# EAGLE design LowPass (EAGLE 9.3.0)
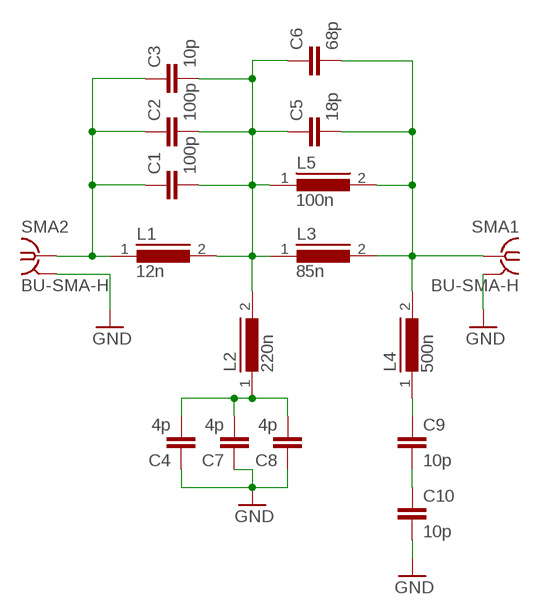
[diagram p0: schematic, sheet 1]

## Parts
C1  100p  C-EUC0805  [C0805]
C2  100p  C-EUC0805  [C0805]
C3  10p  C-EUC0805  [C0805]
C4  4p  C-EUC1206  [C1206]
C5  18p  C-EUC0805  [C0805]
C6  68p  C-EUC0402  [C0402]
C7  4p  C-EUC1206  [C1206]
C8  4p  C-EUC1206  [C1206]
C9  10p  C-EUC0805  [C0805]
C10  10p  C-EUC0805  [C0805]
L1  12n  MICC10  [MICC10]
L2  220n  MICC10  [MICC10]
L3  85n  MICC10  [MICC10]
L4  500n  MICC10  [MICC10]
L5  100n  MICC10  [MICC10]
SMA1  BU-SMA-H  [BU-SMA-H]
SMA2  BU-SMA-H  [BU-SMA-H]

## Nets
GND: C4.1 C7.1 C8.1 C10.2 SMA1.2 SMA1.3 SMA1.4 SMA1.5 SMA2.2 SMA2.3 SMA2.4 SMA2.5
N$3: C1.1 C2.1 C3.1 L1.1 SMA2.1
N$5: C1.2 C2.2 C3.2 C5.1 C6.1 L1.2 L2.2 L3.1 L5.1
N$8: C5.2 C6.2 L3.2 L4.2 L5.2 SMA1.1
N$10: C9.1 L4.1
N$11: C9.2 C10.1
N$12: C4.2 C7.2 C8.2 L2.1

## Library data of the parts
C1-C10 = rcl:C-EU: CAPACITOR, European symbol; SPICEPREFIX: C
L1-L5 = inductors:MICC10: INDUCTOR; SPICEPREFIX: L
SMA1 SMA2 = con-coax:BU-SMA-H: FEMALE SMA CONNECTOR Radiall; OC_FARNELL: unknown; OC_NEWARK: unknown

## Board
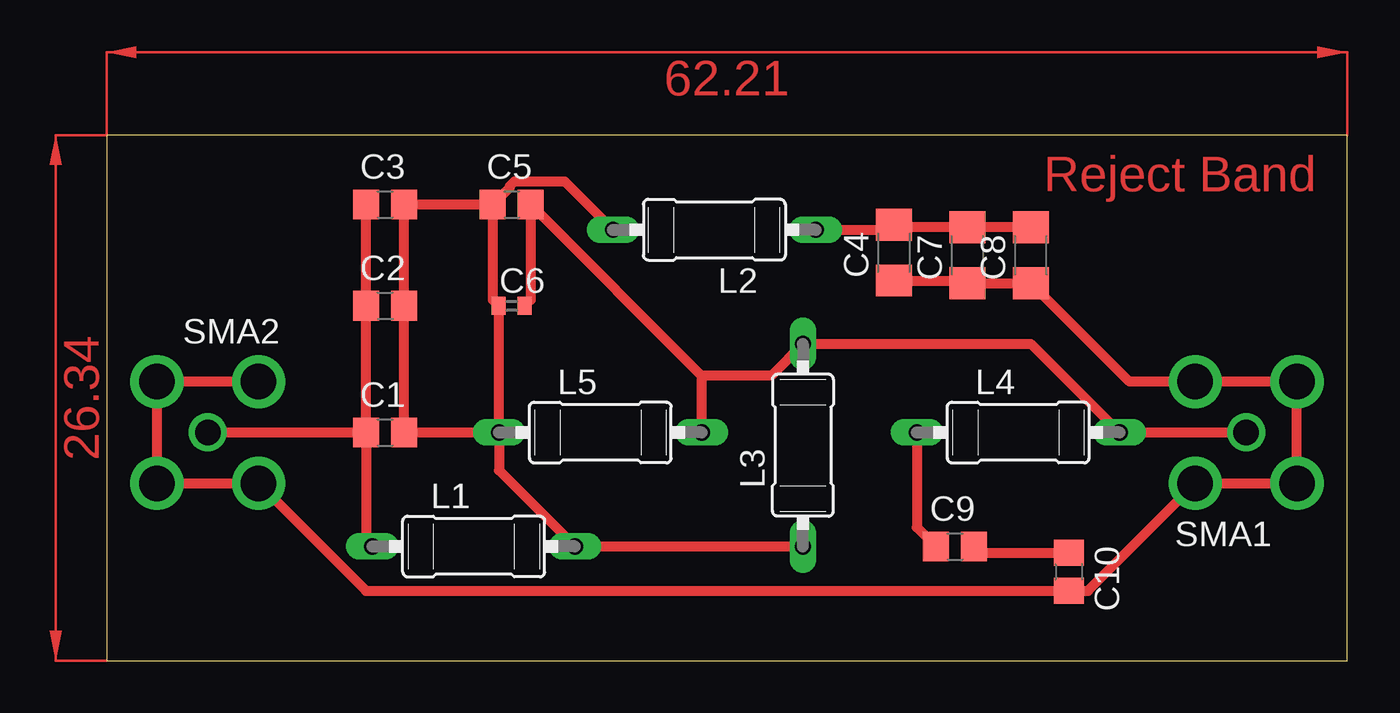
[diagram p1: board, top side]
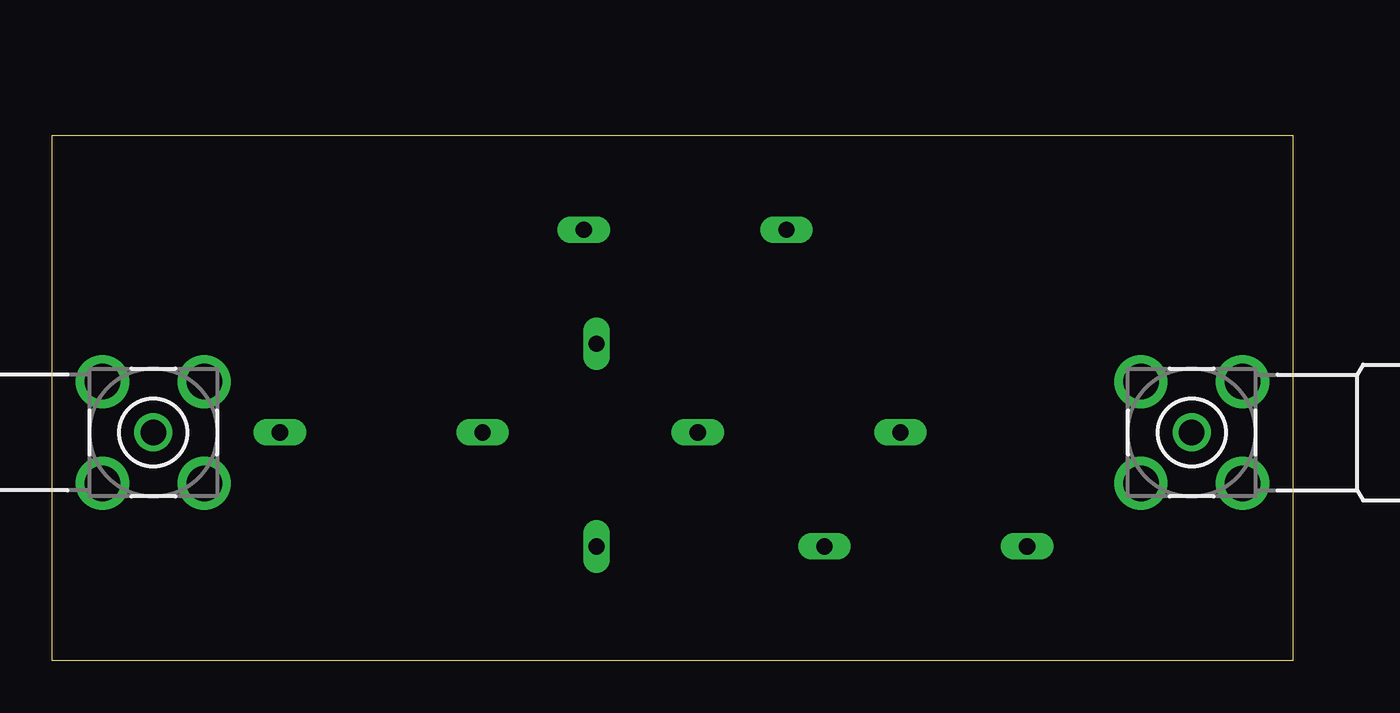
[diagram p2: board, bottom side, seen from below]

Size 62.21 x 26.34 mm. Coordinates in mm from the lower left corner, seen from the top.
Outline: 0,0 62.21,0 62.21,26.34 0,26.34 0,0
Copper layers (1*16): Top 0.035mm / dielectric 1.5mm / Bottom 0.035mm
Design rules "default": minimum track width 6mil, minimum drill 0.35mm, track to track 6mil, track to pad 6mil, pad to pad 6mil, via to via 6mil, smd to smd 6mil, copper to edge 40mil, drill to drill 6mil, minimum pad ring 10mil, minimum via ring 8mil, stop-mask expansion 4mil, vias tented up to drill 0mil, thermal gap 10mil

### Footprints (pad centres in the part's own frame; a part is rotated, then mirrored left to right if it is on the bottom)
C0805 = smd 1.3 x 1.5: 1 -0.95,0; 2 0.95,0
C1206 = smd 1.6 x 1.8: 1 -1.4,0; 2 1.4,0
C0402 = smd 0.7 x 0.9: 1 -0.65,0; 2 0.65,0
MICC10 = drill 0.813 long: 1 -5.08,0; 2 5.08,0
BU-SMA-H = drill 1.27: 1 0,0 | drill 1.778: 2 -2.55,2.55; 3 2.55,2.55; 4 2.55,-2.55; 5 -2.55,-2.55

### Placement (x,y rotation side)
C1  13.97,11.43 0 top
C2  13.97,17.78 0 top
C3  13.97,22.86 0 top
C4  39.5,20.45 90 top
C5  20.32,22.86 0 top
C6  20.32,17.78 0 top
C7  43.18,20.32 90 top
C8  46.35,20.32 90 top
C9  42.54,5.71 0 top
C10  48.26,4.44 270 top
L1  18.42,5.71 0 top
L2  30.48,21.59 180 top
L3  34.92,10.8 90 top
L4  45.72,11.43 0 top
L5  24.77,11.43 0 top
SMA1  57.15,11.43 180 bottom
SMA2  5.08,11.43 0 bottom

### Tracks (layer width: path | path; a pad name or v marks a point on that pad's centre or on a via)
GND
  Top 0.152: 2.59,8.99 2.54,8.89 SMA2.4 | 7.62,8.99 SMA2.5
  Top 0.508: SMA2.2 SMA2.3 SMA2.4 SMA2.5 | C4.1 43.05,19.05 C7.1 C8.1 51.29,13.98 SMA1.5 SMA1.4 SMA1.3 SMA1.2 49.21,3.49 C10.2 13.01,3.49 SMA2.5
  Bottom 0.152: 7.62,8.99 SMA2.5
N$3
  Top 0.508: SMA2.1 C1.1 | C1.1 C2.1 C3.1 | C1.1 13.02,6.03 L1.1
  Top 0.813: L1.1 13.97,5.71
N$5
  Top 0.254: 23.47,5.69 L1.2
  Top 0.508: C5.1 C3.2 C2.2 C1.2 L5.1 | C5.1 19.37,18.08 C6.1 19.69,17.77 L5.1 | L5.1 19.69,9.52 L1.2 | C5.1 20.21,23.7 20.21,23.78 20.45,24.02 22.97,24.02 L2.2 | 24.13,5.71 L3.1
  Top 0.813: L5.1 20.32,11.43
  Top 1.016: L2.2 24.77,21.59 | L3.1 34.92,5.08 | L1.2 24.13,5.71
N$8
  Top 0.508: C6.2 21.27,18.08 C5.2 29.85,14.28 | 29.85,14.28 L5.2 | 29.85,14.28 33.34,14.28 L3.2 46.35,15.88 L4.2 | 51.43,11.43 SMA1.1
  Top 1.016: L3.2 34.92,16.51 | L5.2 30.48,11.43 | L4.2 51.43,11.43
  Bottom 0.152: 50.75,11.43 L4.2
N$10
  Top 0.508: L4.1 40.64,6.67 C9.1
  Top 1.016: L4.1 41.27,11.43
N$11
  Top 0.508: C9.2 43.81,5.39 C10.1
N$12
  Top 0.508: C8.2 C7.2 39.62,21.72 C4.2 39.24,21.59 36.2,21.59
  Top 1.016: L2.1 36.2,21.59
(copper drawn outside any net)
  shapes: Top area x2

### Text on the board
Top: Reject Band